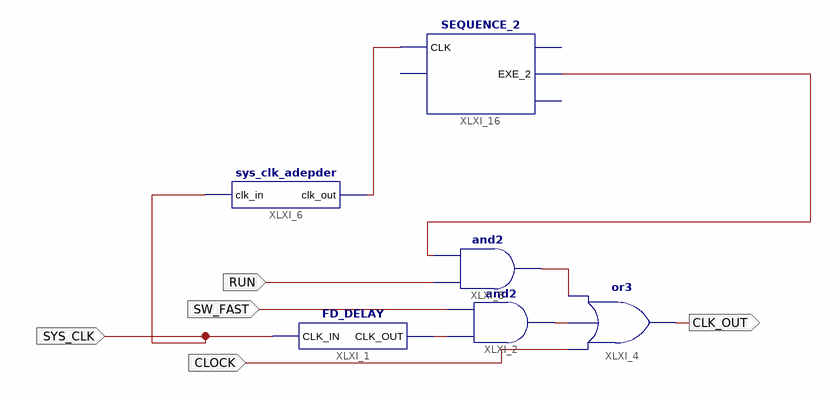
[diagram p0: schematic sheet 1]
// Xilinx ISE schematic SYSTEM_CLK.sch (spartan3e) as structural Verilog: 6 symbols, 5 ports
module SYSTEM_CLK (
  input  SYS_CLK,
  input  SW_FAST,
  input  CLOCK,
  input  RUN,
  output CLK_OUT
);

  wire XLXN_9, XLXN_13, XLXN_17, XLXN_34, XLXN_35;

  FD_DELAY XLXI_1 (.CLK_IN(SYS_CLK), .CLK_OUT(XLXN_9));
  and XLXI_2 (XLXN_13, XLXN_9, SW_FAST);
  or XLXI_4 (CLK_OUT, CLOCK, XLXN_13, XLXN_17);
  and XLXI_5 (XLXN_17, RUN, XLXN_34);
  sys_clk_adepder XLXI_6 (.clk_in(SYS_CLK), .clk_out(XLXN_35));
  SEQUENCE_2 XLXI_16 (.CLK(XLXN_35), .EXE_2(XLXN_34));  // open: CLR, EXE_1, EXE_3
endmodule
